# Altium project MIL_STD_1275D_PROTECTION.PrjPcb (part 3 of 4)
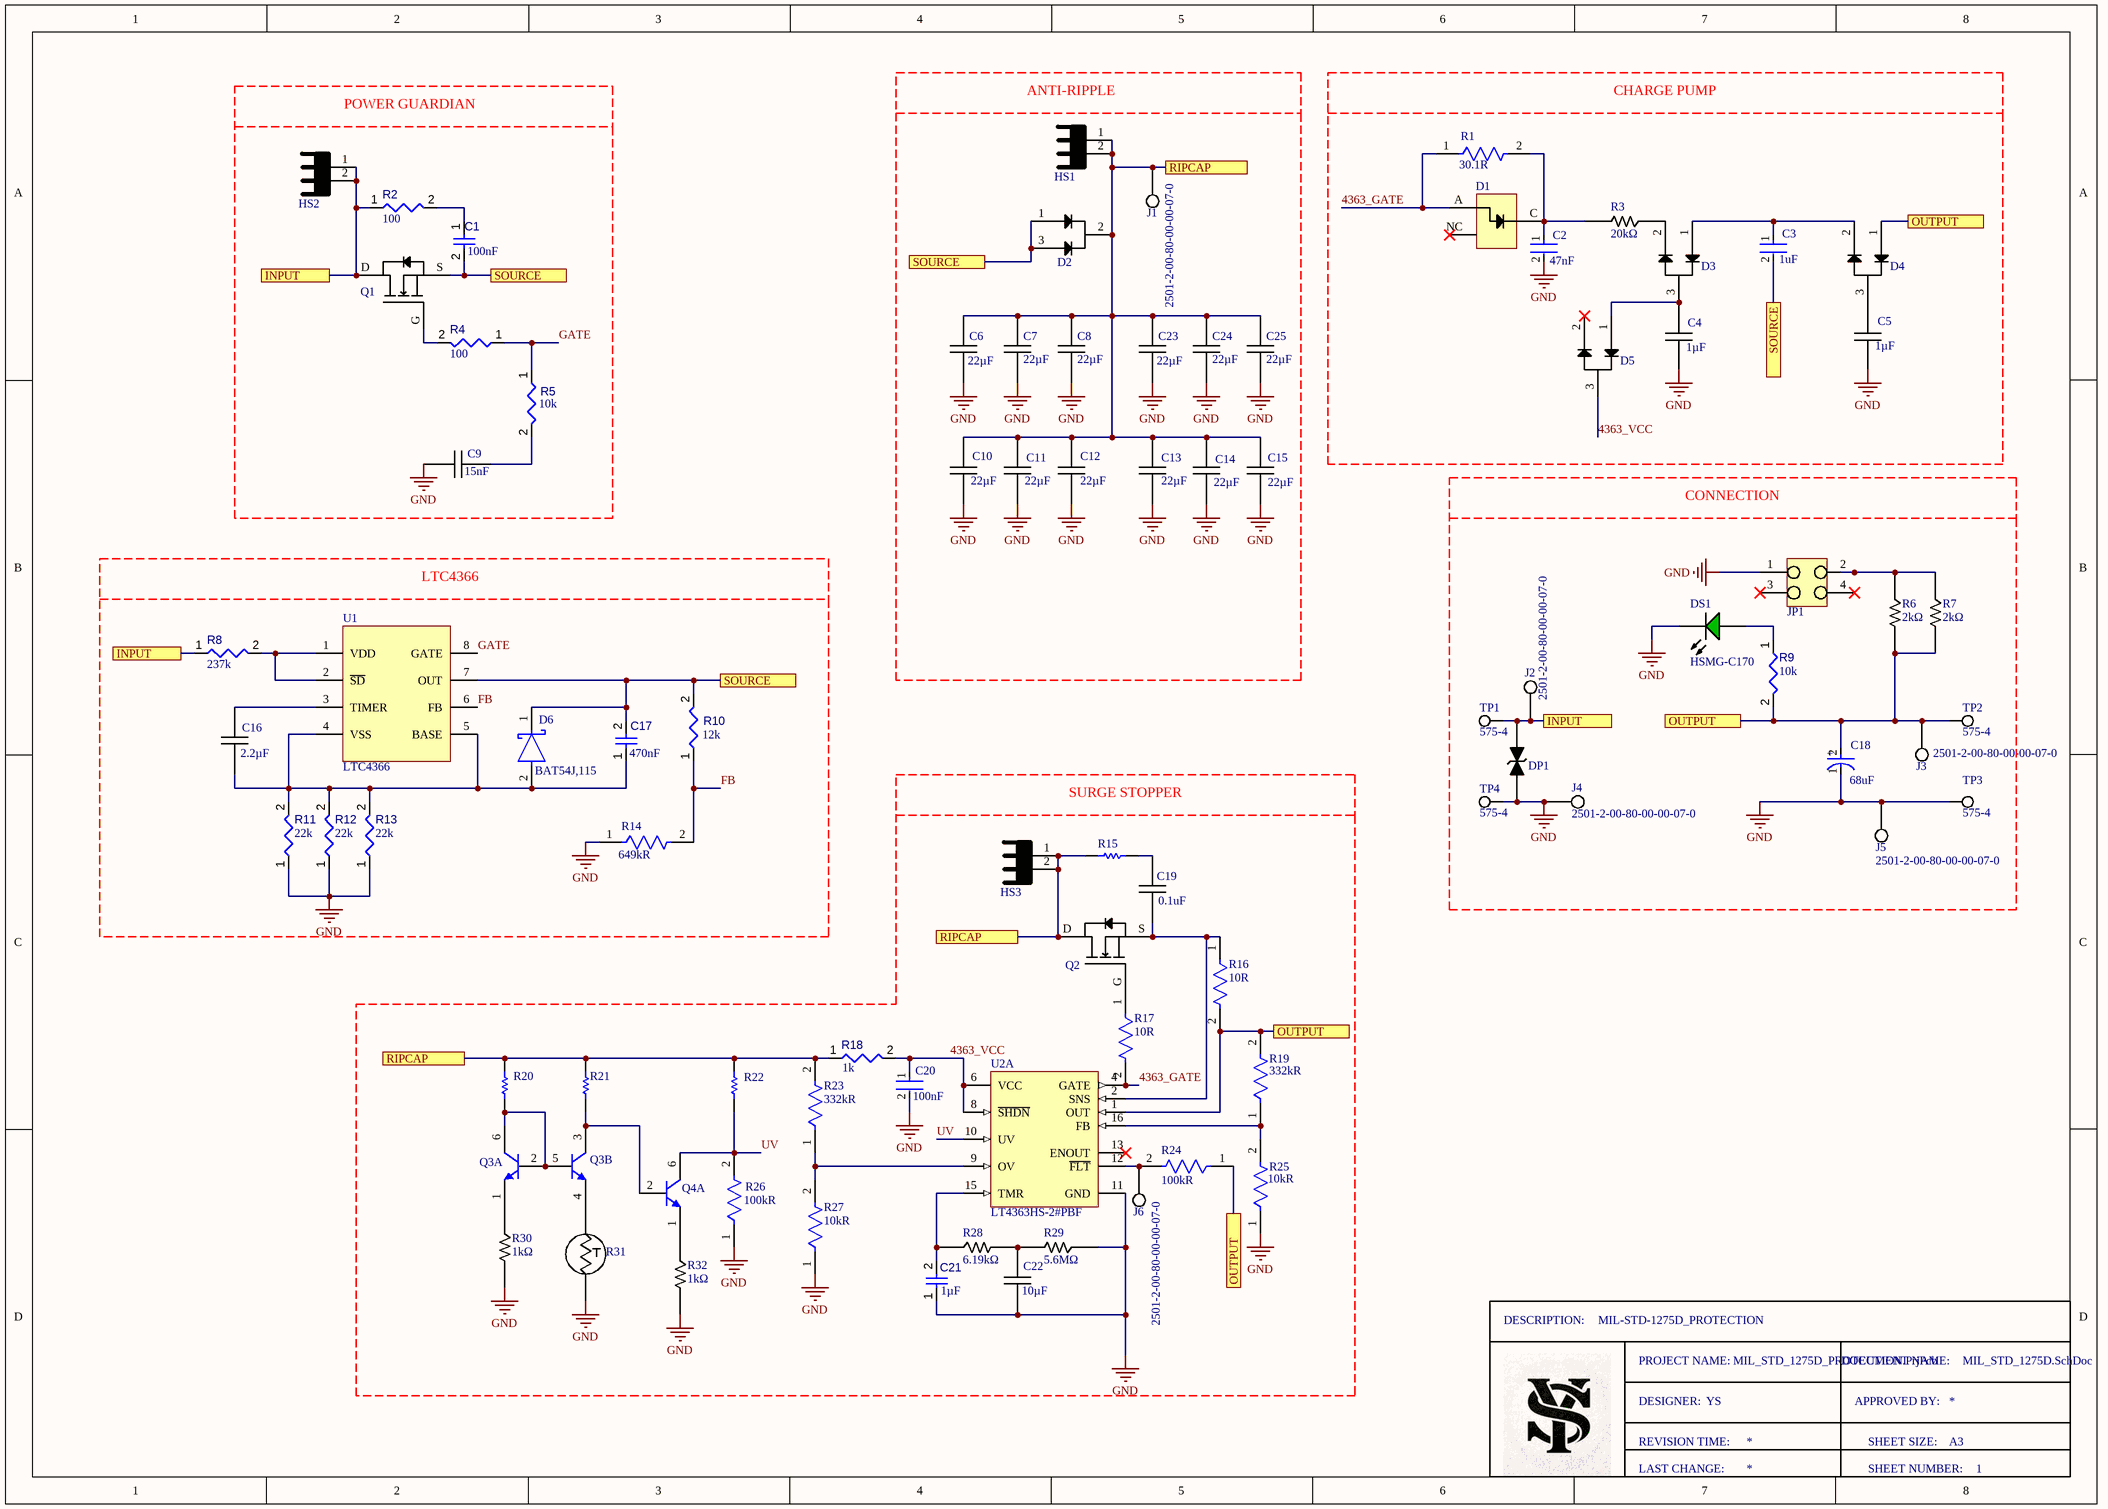
[diagram p2: MIL_STD_1275D.SchDoc]

## Sheet MIL_STD_1275D.SchDoc: MIL-STD-1275D_PROTECTION (continued)

### Library data of the parts (continued)
Q2 = IXTQ170N10P: Trans MOSFET N-CH 100V 170A 3-Pin(3+Tab) TO-3P; Manufacturer: Littelfuse; Drain to Source Resistance: 9mΩ; Element Configuration: Single; Fall Time: 33ns; Gate to Source Voltage (Vgs): 20V; Input Capacitance: 6nF; Max Power Dissipation: 715W; Number of Elements: 1; Reverse Recovery Time: 120ns; Rise Time: 50ns; Threshold Voltage: 5V; Turn-Off Delay Time: 90ns; Designed by: YS; Supplier: Farnell; Supplier Part Number: IXTQ170N10P; Manufacturer Part Number: IXTQ170N10P; RoHS: Compliant; Category: MOSFETs; Pricing: 1=5,85, 25=5,45, 100=4,45, 250=3,98, 500=3,68 (EUR); China RoHS: Compliant; Continuous Drain Current (ID): 170A; Drain to Source Breakdown Voltage: 100V; Drain to Source Voltage (Vdss): 100V; Export Control Classification Number (ECCN) Code: EAR99; Introduction Date: 2004-06-09; Lifecycle Status: Production; Max Operating Temperature: 175°C; Min Breakdown Voltage: 100V; Min Operating Temperature: -55°C; Mounting Technology: Through Hole; Pins: 3; Number of Terminals: 3; Power Dissipation: 715W; Rds On Max: 9mΩ; REACH SVHC: Yes; ComponentLink1URL: https://datasheet.octopart.com:443/IXTQ170N10P-Littelfuse-datasheet-140812726.pdf?src-supplier=IHS; ComponentLink1Description: https://datasheet.octopart.com:443/IXTQ170N10P-Littelfuse-datasheet-140812726.pdf?src-supplier=IHS; ComponentLink2URL: https://datasheet.octopart.com:443/IXTQ170N10P-Littelfuse-datasheet-180607976.pdf?src-supplier=IHS; ComponentLink2Description: https://datasheet.octopart.com:443/IXTQ170N10P-Littelfuse-datasheet-180607976.pdf?src-supplier=IHS; ComponentLink3URL: https://datasheet.octopart.com:443/IXTQ170N10P-IXYS-datasheet-11764712.pdf?src-supplier=LKR; ComponentLink3Description: https://datasheet.octopart.com:443/IXTQ170N10P-IXYS-datasheet-11764712.pdf?src-supplier=LKR; ComponentLink4URL: https://datasheet.octopart.com:443/IXTQ170N10P-IXYS-datasheet-5325121.pdf?src-supplier=element14+APAC; ComponentLink4Description: https://datasheet.octopart.com:443/IXTQ170N10P-IXYS-datasheet-5325121.pdf?src-supplier=element14+APAC; ComponentLink5URL: https://datasheet.octopart.com:443/IXTQ170N10P-IXYS-datasheet-10725190.pdf?src-supplier=iiiC; ComponentLink5Description: https://datasheet.octopart.com:443/IXTQ170N10P-IXYS-datasheet-10725190.pdf?src-supplier=iiiC
Q3 Q4 = CMP-2000-06740-1: Dual NPN Small Signal Surface Mount Transistor, 160 V, 200 mA, -55 to 150 degC, 6-Pin SOT-363, RoHS, Tape and Reel; Collector- Base Voltage VCBO: 180V; DC Collector/Base Gain hfe Min: 80; Unit Weight: 0.000212oz; Brand: DiodesIncorporated; Maximum DC Collector Current: 0.2A; Collector- Emitter Voltage VCEO Max: 160V; Gain Bandwidth Product fT: 300MHz; Pd - Power Dissipation: 0.2W; Emitter- Base Voltage VEBO: 6V; Collector-Emitter Saturation Voltage: 0.2V; DC Current Gain hFE Max: 250; Mounting Technology: SurfaceMount; Maximum Operating Temperature: +150C; Packaging: Reel; Height: 1mm; Datasheet Version: Rev. 8-2, 05/2009; Manufacturer: DiodesIncorporated; RoHS: True; Datasheet URL: http://www.diodes.com/_files/datasheets/ds30172.pdf; Product Category: BipolarTransistors-BJT; Minimum Operating Temperature: -55C; Package Reference: SOT-363-6; Configuration: Dual; Continuous Collector Current: 0.2A; Transistor Polarity: NPN; Package / Case: SOT-363; Width: 1.35mm; Package Description: 6-Pin Small Outline Transistor, Body 2 x 1.25 mm, Pitch 0.65 mm; Mounting Style: SMD/SMT; Length: 2.2mm; Manufacturer URL: http://www.diodes.com/; Series: MMDT55; Factory Pack Quantity: 3000
R1 = CMP-2001-03812-2: RES Thick Film, 30.1Ω, 1%, 0.125W, 100ppm/°C, 0805; Max Power Dissipation: 125mW; Voltage Rating: 150V; Max Operating Temperature: 155°C; Composition: Thick Film; Case Code (Imperial): 0805; Package Quantity: 10; Tolerance: 1%; Number of Terminations: 2; Packaging: Tape and Reel; Features: Automotive AEC-Q200; Width: 0.049inch; Depth: 1.25mm; Length: 2mm; Case/Package: 0805; Military Standard: Not; Height: 0.02inch; Weight: 0.000194oz; Case Code (Metric): 2012; Termination: SMD/SMT; Power Rating: 125mW; Radiation Hardening: No; Temperature Coefficient: 100ppm/°C; Number of Pins: 2; Contact Plating: Tin; Min Operating Temperature: -55°C
R2 R4 = CMP-009-00167-3: Chip Resistor, 100 Ohms, +/-1 %, 63 mW, -55 to 155 degC, 0402; Power: 63mW; Tolerance: 1%; Min Operating Temperature: -55°C; Case/Package: 0402; Pins: 2; Max Operating Temperature: 155°C
R3 = CRCW080520K0JNEA: Fixed Resistor, Metal Glaze/Thick Film, 0.125W, 20000ohm, 150V, 5% +/-Tol, Surface Mount, 0805; Manufacturer: Vishay; Manufacturer Package Identifier: CRCW0805-e3; Max Power Dissipation: 125mW; Temperature Coefficient: 200ppm/°C; Designed by: YS; Supplier: Mouser; Supplier Part Number: 71-CRCW0805J-20K-E3; Manufacturer Part Number: CRCW080520K0JNEA; RoHS: Compliant; Category: Chip SMD Resistors; Stock: 5247; Pricing: 1=0,1, 10=0,023, 50=0,023, 100=0,019, 1000=0,011, 10000=0,005 (USD); Case/Package: 0805; Case Code (Imperial): 0805; China RoHS: Non-Compliant; Composition: Thick Film; Contact Plating: Tin; Country of Origin: Israel; Depth: 1.25mm; Export Control Classification Number (ECCN) Code: EAR99; Features: Automotive AEC-Q200; Height: 450µm; Harmonized Tariff Schedule (HTS) Code: 8533.21.00.30; Introduction Date: 2005-02-16; Lead Free: Lead Free; Length: 2mm; Lifecycle Status: Production; Max Operating Temperature: 155°C; Military Standard: Not; Min Operating Temperature: -55°C; Mounting Technology: Surface Mount; Pins: 2; Number of Terminals: 2; Number of Terminations: 2; Packaging: Cut Tape; Power Rating: 125mW; Radiation Hardening: No; Ratings: AEC-Q200; REACH SVHC: Yes; Schedule B: 8533210045; Termination: Solder; Tolerance: 5%; Voltage Rating: 150V; Voltage Rating (DC): 150V; Weight: 5.499807mg; Width: 1.25mm; Working Voltage: 150V; ComponentLink1URL: https://datasheet.octopart.com:443/CRCW080520K0JNEA-Vishay-datasheet-175423584.pdf?src-supplier=IHS; ComponentLink1Description: https://datasheet.octopart.com:443/CRCW080520K0JNEA-Vishay-datasheet-175423584.pdf?src-supplier=IHS; ComponentLink2URL: https://datasheet.octopart.com:443/CRCW080520K0JNEA-Vishay-datasheet-190005712.pdf?src-supplier=TME; ComponentLink2Description: https://datasheet.octopart.com:443/CRCW080520K0JNEA-Vishay-datasheet-190005712.pdf?src-supplier=TME; ComponentLink3URL: https://datasheet.octopart.com:443/CRCW080520K0JNEA-Vishay-datasheet-68554530.pdf?src-supplier=Farnell; ComponentLink3Description: https://datasheet.octopart.com:443/CRCW080520K0JNEA-Vishay-datasheet-68554530.pdf?src-supplier=Farnell; ComponentLink4URL: https://datasheet.octopart.com:443/CRCW080520K0JNEA-Vishay-datasheet-31669108.pdf?src-supplier=Farnell; ComponentLink4Description: https://datasheet.octopart.com:443/CRCW080520K0JNEA-Vishay-datasheet-31669108.pdf?src-supplier=Farnell; ComponentLink5URL: https://datasheet.octopart.com:443/CRCW080520K0JNEA-Vishay-datasheet-33013972.pdf?src-supplier=element14+APAC; ComponentLink5Description: https://datasheet.octopart.com:443/CRCW080520K0JNEA-Vishay-datasheet-33013972.pdf?src-supplier=element14+APAC; ComponentLink6URL: https://datasheet.octopart.com:443/CRCW080520K0JNEA-Vishay-datasheet-62317937.pdf?src-supplier=Newark; ComponentLink6Description: https://datasheet.octopart.com:443/CRCW080520K0JNEA-Vishay-datasheet-62317937.pdf?src-supplier=Newark; ComponentLink7URL: https://datasheet.octopart.com:443/CRCW080520K0JNEA-Vishay-datasheet-159614168.pdf?src-supplier=Newark; ComponentLink7Description: https://datasheet.octopart.com:443/CRCW080520K0JNEA-Vishay-datasheet-159614168.pdf?src-supplier=Newark; ComponentLink8URL: https://datasheet.octopart.com:443/CRCW080520K0JNEA-Vishay-datasheet-66077789.pdf?src-supplier=Newark; ComponentLink8Description: https://datasheet.octopart.com:443/CRCW080520K0JNEA-Vishay-datasheet-66077789.pdf?src-supplier=Newark; ComponentLink9URL: https://datasheet.octopart.com:443/CRCW080520K0JNEA-Vishay-datasheet-41302739.pdf?src-supplier=Newark; ComponentLink9Description: https://datasheet.octopart.com:443/CRCW080520K0JNEA-Vishay-datasheet-41302739.pdf?src-supplier=Newark; ComponentLink10URL: https://datasheet.octopart.com:443/CRCW080520K0JNEA-Vishay-datasheet-62316122.pdf?src-supplier=Future+Electronics; ComponentLink10Description: https://datasheet.octopart.com:443/CRCW080520K0JNEA-Vishay-datasheet-62316122.pdf?src-supplier=Future+Electronics; ComponentLink11URL: https://datasheet.octopart.com:443/CRCW080520K0JNEA-Vishay-datasheet-5300368.pdf?src-supplier=Future+Electronics; ComponentLink11Description: https://datasheet.octopart.com:443/CRCW080520K0JNEA-Vishay-datasheet-5300368.pdf?src-supplier=Future+Electronics; ComponentLink12URL: https://datasheet.octopart.com:443/CRCW080520K0JNEA-Vishay-Dale-datasheet-47688880.pdf?src-supplier=RS+(Formerly+Allied+Electronics); ComponentLink12Description: https://datasheet.octopart.com:443/CRCW080520K0JNEA-Vishay-Dale-datasheet-47688880.pdf?src-supplier=RS+(Formerly+Allied+Electronics); ComponentLink13URL: https://datasheet.octopart.com:443/CRCW080520K0JNEA-Vishay-datasheet-12001583.pdf?src-supplier=RS+(Formerly+Allied+Electronics); ComponentLink13Description: https://datasheet.octopart.com:443/CRCW080520K0JNEA-Vishay-datasheet-12001583.pdf?src-supplier=RS+(Formerly+Allied+Electronics); ComponentLink14URL: https://datasheet.octopart.com:443/CRCW080520K0JNEA-Vishay-datasheet-5306405.pdf?src-supplier=RS+(Formerly+Allied+Electronics); ComponentLink14Description: https://datasheet.octopart.com:443/CRCW080520K0JNEA-Vishay-datasheet-5306405.pdf?src-supplier=RS+(Formerly+Allied+Electronics); ComponentLink15URL: https://datasheet.octopart.com:443/CRCW080520K0JNEA-Vishay-datasheet-11540273.pdf?src-supplier=Arrow+Electronics; ComponentLink15Description: https://datasheet.octopart.com:443/CRCW080520K0JNEA-Vishay-datasheet-11540273.pdf?src-supplier=Arrow+Electronics; ComponentLink16URL: https://datasheet.octopart.com:443/CRCW080520K0JNEA-Vishay-datasheet-8445837.pdf?src-supplier=element14; ComponentLink16Description: https://datasheet.octopart.com:443/CRCW080520K0JNEA-Vishay-datasheet-8445837.pdf?src-supplier=element14; ComponentLink17URL: https://datasheet.octopart.com:443/CRCW080520K0JNEA-Vishay-datasheet-5377306.pdf?src-supplier=Garrett; ComponentLink17Description: https://datasheet.octopart.com:443/CRCW080520K0JNEA-Vishay-datasheet-5377306.pdf?src-supplier=Garrett; ComponentLink18URL: https://datasheet.octopart.com:443/CRCW080520K0JNEA-Vishay-datasheet-148188.pdf?src-supplier=Garrett; ComponentLink18Description: https://datasheet.octopart.com:443/CRCW080520K0JNEA-Vishay-datasheet-148188.pdf?src-supplier=Garrett; ComponentLink19URL: https://datasheet.octopart.com:443/CRCW080520K0JNEA-Vishay-datasheet-34203.pdf?src-supplier=Garrett; ComponentLink19Description: https://datasheet.octopart.com:443/CRCW080520K0JNEA-Vishay-datasheet-34203.pdf?src-supplier=Garrett; ComponentLink20URL: http://sigma.octopart.com:80/rohs_statement/Vishay-company-15.pdf?src-supplier=Compliance+Statements; ComponentLink20Description: http://sigma.octopart.com:80/rohs_statement/Vishay-company-15.pdf?src-supplier=Compliance+Statements
R5 = CMP-009-00019-5: Chip Resistor, 10 KOhm, +/- 1%, 63 mW, -55 to 155 degC, 0402 (1005 Metric); Power: 63mW; Voltage Rating: 50V; Case/Package: 0402; Mounting Technology: SM; Pins: 2; Min Operating Temperature: -55°C; Tolerance: 1%; RoHS Compliant: True; Max Operating Temperature: 155°C
R6 R7 = CRCW20102K00FKEFHP: Res Thick Film 2010 2K Ohm 1% 1W ±100ppm/C Pad SMD T/R Automotive AEC-Q200; Manufacturer: Vishay; Temperature Coefficient: 100ppm/°C; Voltage Rating: 400V; Supplier: Farnell; Supplier Part Number: CRCW20102K00FKEFHP; Manufacturer Part Number: CRCW20102K00FKEFHP; RoHS: Compliant; Category: Chip SMD Resistors; Stock: 1815; Pricing: 10=0,289, 100=0,235, 500=0,219, 1000=0,199, 2000=0,182, 4000=0,169 (EUR); Case/Package: 2010; Case Code (Imperial): 2010; Case Code (Metric): 5025; China RoHS: Non-Compliant; Composition: Thick Film; Contact Plating: Tin; Country of Origin: Israel; Export Control Classification Number (ECCN) Code: EAR99; Features: Automotive AEC-Q200; Height: 600µm; Harmonized Tariff Schedule (HTS) Code: 8533.21.00.30; Introduction Date: 2008-07-29; Lead Free: Lead Free; Length: 5mm; Lifecycle Status: Production; Max Operating Temperature: 155°C; Max Power Dissipation: 1W; Min Operating Temperature: -55°C; Mounting Technology: Surface Mount; Number of Terminals: 2; Number of Terminations: 2; Power Rating: 1W; Radiation Hardening: No; Ratings: AEC-Q200; REACH SVHC: Yes; Schedule B: 8533210045, 8533210045|8533210045|8533210045|8533210045|8533210045; Tolerance: 1%; Voltage Rating (DC): 400V; Weight: 25.486221mg; Width: 2.5mm; Working Voltage: 400V; ComponentLink1URL: https://datasheet.octopart.com:443/CRCW20102K00FKEFHP-Vishay-datasheet-83567917.pdf?src-supplier=Upverter; ComponentLink1Description: https://datasheet.octopart.com:443/CRCW20102K00FKEFHP-Vishay-datasheet-83567917.pdf?src-supplier=Upverter; ComponentLink2URL: https://datasheet.octopart.com:443/CRCW20102K00FKEFHP-Vishay-datasheet-62316122.pdf?src-supplier=Future+Electronics; ComponentLink2Description: https://datasheet.octopart.com:443/CRCW20102K00FKEFHP-Vishay-datasheet-62316122.pdf?src-supplier=Future+Electronics; ComponentLink3URL: https://datasheet.octopart.com:443/CRCW20102K00FKEFHP-Vishay-datasheet-13148866.pdf?src-supplier=Future+Electronics; ComponentLink3Description: https://datasheet.octopart.com:443/CRCW20102K00FKEFHP-Vishay-datasheet-13148866.pdf?src-supplier=Future+Electronics; ComponentLink4URL: https://datasheet.octopart.com:443/CRCW20102K00FKEFHP-Vishay-datasheet-13131392.pdf?src-supplier=Future+Electronics; ComponentLink4Description: https://datasheet.octopart.com:443/CRCW20102K00FKEFHP-Vishay-datasheet-13131392.pdf?src-supplier=Future+Electronics; ComponentLink5URL: https://datasheet.octopart.com:443/CRCW20102K00FKEFHP-Vishay-datasheet-12593106.pdf?src-supplier=Future+Electronics; ComponentLink5Description: https://datasheet.octopart.com:443/CRCW20102K00FKEFHP-Vishay-datasheet-12593106.pdf?src-supplier=Future+Electronics; ComponentLink6URL: https://datasheet.octopart.com:443/CRCW20102K00FKEFHP-Vishay-datasheet-12544674.pdf?src-supplier=Future+Electronics; ComponentLink6Description: https://datasheet.octopart.com:443/CRCW20102K00FKEFHP-Vishay-datasheet-12544674.pdf?src-supplier=Future+Electronics; ComponentLink7URL: https://datasheet.octopart.com:443/CRCW20102K00FKEFHP-Vishay-datasheet-12531795.pdf?src-supplier=Future+Electronics; ComponentLink7Description: https://datasheet.octopart.com:443/CRCW20102K00FKEFHP-Vishay-datasheet-12531795.pdf?src-supplier=Future+Electronics; ComponentLink8URL: https://datasheet.octopart.com:443/CRCW20102K00FKEFHP-Vishay-datasheet-12518686.pdf?src-supplier=Future+Electronics; ComponentLink8Description: https://datasheet.octopart.com:443/CRCW20102K00FKEFHP-Vishay-datasheet-12518686.pdf?src-supplier=Future+Electronics; ComponentLink9URL: https://datasheet.octopart.com:443/CRCW20102K00FKEFHP-Vishay-datasheet-12509906.pdf?src-supplier=Future+Electronics; ComponentLink9Description: https://datasheet.octopart.com:443/CRCW20102K00FKEFHP-Vishay-datasheet-12509906.pdf?src-supplier=Future+Electronics; ComponentLink10URL: https://datasheet.octopart.com:443/CRCW20102K00FKEFHP-Vishay-datasheet-10669844.pdf?src-supplier=Future+Electronics; ComponentLink10Description: https://datasheet.octopart.com:443/CRCW20102K00FKEFHP-Vishay-datasheet-10669844.pdf?src-supplier=Future+Electronics; ComponentLink11URL: https://datasheet.octopart.com:443/CRCW20102K00FKEFHP-Vishay-datasheet-8703221.pdf?src-supplier=Future+Electronics; ComponentLink11Description: https://datasheet.octopart.com:443/CRCW20102K00FKEFHP-Vishay-datasheet-8703221.pdf?src-supplier=Future+Electronics; ComponentLink12URL: http://sigma.octopart.com:80/rohs_statement/Vishay-company-15.pdf?src-supplier=Compliance+Statements; ComponentLink12Description: http://sigma.octopart.com:80/rohs_statement/Vishay-company-15.pdf?src-supplier=Compliance+Statements
R8 = CMP-009-00150-3: Chip Resistor, 237 kOhms, +/-1 %, 63 mW, -55 to 155 degC, 0402; Power: 63mW; Tolerance: 1%; Min Operating Temperature: -55°C; Max Operating Temperature: 155°C; Pins: 2; Case/Package: 0402
R9 = CMP-009-00016-5: Chip Resistor, 10 KOhm, +/- 1%, 0.25 W, -55 to 155 degC, 1206 (3216 Metric); Power: 250mW; Voltage Rating: 200V; Pins: 2; Max Operating Temperature: 155°C; Tolerance: 1%; RoHS Compliant: True; Case/Package: 1206; Min Operating Temperature: -55°C; Mounting Technology: SM
R10 = CMP-009-00071-2: 12K 0.063W 1% 0402 (1005 Metric)  SMD; Power: 63mW; Tolerance: 1%; Case/Package: 0402; Mounting Technology: SMT; Pins: 2
R11-R13 = CMP-009-00081-2: 22K 0.063W 1% 0402 (1005 Metric)  SMD; Power: 63mW; Tolerance: 1%; Pins: 2; Mounting Technology: SMT; Case/Package: 0402
R14 = CMP-2003-02329-2: RES Thick Film, 649kΩ, 1%, 0.25W, 100ppm/°C, 1206; Voltage Rating (DC): 200V; Max Power Dissipation: 250mW; Height: 0.024inch; Min Operating Temperature: -55°C; Military Standard: Not; Lead Free: Lead Free; Composition: Thick Film; Case Code (Imperial): 1206; Tolerance: 1%; Case/Package: 1206; Features: Automotive AEC-Q200; Package Quantity: 10; Contact Plating: Tin; Weight: 0.000353oz; Termination: SMD/SMT; Radiation Hardening: No; Case Code (Metric): 3216; Max Operating Temperature: 155°C; Temperature Coefficient: 100ppm/°C; Power Rating: 250mW; Depth: 1.6mm; Packaging: Tape and Reel; Length: 3.2mm; Voltage Rating: 200V; Number of Pins: 2; Width: 0.063inch; Number of Terminations: 2
R15 = CMP-2005-00215-1: Manufacturer: Vishay Dale; Part Number: CRCW1210100RJNEAHP
R16 R17 = CMP-2001-04916-2: RES Thick Film, 10Ω, 5%, 0.125W, 200ppm/°C, 0805; Max Power Dissipation: 125mW; Voltage Rating: 150V; Depth: 1.25mm; Weight: 0.000194oz; Length: 2mm; Features: Automotive AEC-Q200; Package Quantity: 1; Width: 1.25mm; Radiation Hardening: No; Case Code (Metric): 2012; Min Operating Temperature: -55°C; Max Operating Temperature: 155°C; Tolerance: 5%; Packaging: Tape and Reel; Termination: SMD/SMT; Number of Pins: 2; Number of Terminations: 2; Voltage Rating (DC): 150V; Temperature Coefficient: 200ppm/°C; Power Rating: 125mW; Case Code (Imperial): 0805; Lead Free: Lead Free; Composition: Thick Film; Height: 0.02inch; Military Standard: Not; Contact Plating: Tin; Case/Package: 0805; Mount: Surface Mount
R18 = CMP-009-00075-2: 1K 0.063W 5% 0402 (1005 Metric)  SMD; Power: 63mW; Pins: 2; Mounting Technology: SMT; Case/Package: 0402; Tolerance: 5%
R19 R23 = CMP-2001-03825-2: RES Thick Film, 332kΩ, 1%, 0.125W, 100ppm/°C, 0805; Voltage Rating: 150V; Power Rating: 125mW; Min Operating Temperature: -55°C; Max Operating Temperature: 155°C; Temperature Coefficient: 100ppm/°C; Height: 0.45mm; Number of Pins: 2; Composition: Thick Film; Weight: 0.000194oz; Features: Automotive AEC-Q200; Termination: SMD/SMT; Tolerance: 1%; Contact Plating: Tin; Case/Package: 0805; Number of Terminations: 2; Package Quantity: 10; Case Code (Metric): 2012; Packaging: Tape and Reel; Case Code (Imperial): 0805; Width: 0.049inch; Max Power Dissipation: 125mW; Radiation Hardening: No; Lead Free: Lead Free; Military Standard: Not; Voltage Rating (DC): 150V; Depth: 1.25mm; Length: 2mm
R20-R22 = CMP-2001-03800-1: Manufacturer: Vishay Dale; Part Number: CRCW0805301KFKEA
R24 R26 = CMP-2001-04899-2: RES Thick Film, 100kΩ, 1%, 0.125W, 100ppm/°C, 0805; Power Rating: 125mW; Voltage Rating: 150V; Case/Package: 0805; Max Operating Temperature: 155°C; Case Code (Imperial): 0805; Lead Free: Lead Free; Weight: 0.000194oz; Number of Pins: 2; Package Quantity: 5000; Height: 0.45mm; Composition: Thick Film; Military Standard: Not; Tolerance: 1%; Case Code (Metric): 2012; Termination: SMD/SMT; Mount: Surface Mount; Radiation Hardening: No; Width: 1.25mm; Length: 2mm; Depth: 1.25mm; Packaging: Tape and Reel; Min Operating Temperature: -55°C; Contact Plating: Tin; Temperature Coefficient: 100ppm/°C; Voltage Rating (DC): 150V
R25 R27 = CMP-2001-04908-2: RES Thick Film, 10kΩ, 1%, 0.125W, 100ppm/°C, 0805; Voltage Rating (DC): 150V; Power Rating: 125mW; Weight: 0.000194oz; Package Quantity: 5000; Military Standard: Not; Max Operating Temperature: 155°C; Temperature Coefficient: 100ppm/°C; Contact Plating: Tin; Width: 1.25mm; Height: 0.45mm; Radiation Hardening: No; Tolerance: 1%; Min Operating Temperature: -55°C; Voltage Rating: 150V; Length: 2mm; Depth: 1.25mm; Termination: SMD/SMT; Packaging: Tape and Reel; Case/Package: 0805; Case Code (Metric): 2012; Lead Free: Lead Free; Case Code (Imperial): 0805; Composition: Thick Film
R28 = CRCW08056K19FKEA: Fixed Resistor, Metal Glaze/Thick Film, 0.125W, 6190ohm, 150V, 1% +/-Tol, Surface Mount, 0805; Manufacturer: Vishay; Manufacturer Package Identifier: CRCW0805-e3; Power Rating: 125mW; Temperature Coefficient: 100ppm/°C; Designed by: YS; Supplier: Mouser; Supplier Part Number: 71-CRCW0805-6.19K-E3; Manufacturer Part Number: CRCW08056K19FKEA; RoHS: Compliant; Category: Chip SMD Resistors; Stock: 16143; Pricing: 1=0,1, 10=0,028, 50=0,028, 100=0,023, 1000=0,014, 10000=0,007 (USD); Case/Package: 0805; Case Code (Imperial): 0805; China RoHS: Non-Compliant; Composition: Thick Film; Contact Plating: Tin; Depth: 1.25mm; Height: 450µm; Lead Free: Lead Free; Length: 2mm; Lifecycle Status: Production; Max Operating Temperature: 155°C; Military Standard: Not; Min Operating Temperature: -55°C; Mounting Technology: Surface Mount; Pins: 2; Number of Terminals: 2; Packaging: Cut Tape; Ratings: AEC-Q200; REACH SVHC: Yes; Schedule B: 8533210045, 8533210045|8533210045|8533210045|8533210045|8533210045|8533210045|8533210045|8533210045|8533210045|8533210045|8533210045|8533210045|8533210045|8533210045|8533210045|8533210045|8533210045|8533210045|8533210045|8533210045|8533210045|8533210045|8533210045|85; Termination: SMD/SMT; Tolerance: 1%; Voltage Rating: 150V; Voltage Rating (DC): 150V; Weight: 5.499807mg; Width: 1.25mm; Working Voltage: 150V; ComponentLink1URL: https://datasheet.octopart.com:443/CRCW08056K19FKEA-Vishay-datasheet-175423584.pdf?src-supplier=IHS; ComponentLink1Description: https://datasheet.octopart.com:443/CRCW08056K19FKEA-Vishay-datasheet-175423584.pdf?src-supplier=IHS; ComponentLink2URL: https://datasheet.octopart.com:443/CRCW08056K19FKEA-Vishay-datasheet-190005712.pdf?src-supplier=TME; ComponentLink2Description: https://datasheet.octopart.com:443/CRCW08056K19FKEA-Vishay-datasheet-190005712.pdf?src-supplier=TME; ComponentLink3URL: https://datasheet.octopart.com:443/CRCW08056K19FKEA-Vishay-datasheet-83961561.pdf?src-supplier=Farnell; ComponentLink3Description: https://datasheet.octopart.com:443/CRCW08056K19FKEA-Vishay-datasheet-83961561.pdf?src-supplier=Farnell; ComponentLink4URL: https://datasheet.octopart.com:443/CRCW08056K19FKEA-Vishay-datasheet-62317937.pdf?src-supplier=Farnell; ComponentLink4Description: https://datasheet.octopart.com:443/CRCW08056K19FKEA-Vishay-datasheet-62317937.pdf?src-supplier=Farnell; ComponentLink5URL: https://datasheet.octopart.com:443/CRCW08056K19FKEA-Vishay-datasheet-14722531.pdf?src-supplier=Farnell; ComponentLink5Description: https://datasheet.octopart.com:443/CRCW08056K19FKEA-Vishay-datasheet-14722531.pdf?src-supplier=Farnell; ComponentLink6URL: https://datasheet.octopart.com:443/CRCW08056K19FKEA-Vishay-datasheet-5299586.pdf?src-supplier=Farnell; ComponentLink6Description: https://datasheet.octopart.com:443/CRCW08056K19FKEA-Vishay-datasheet-5299586.pdf?src-supplier=Farnell; ComponentLink7URL: https://datasheet.octopart.com:443/CRCW08056K19FKEA-Vishay-datasheet-10380026.pdf?src-supplier=Farnell; ComponentLink7Description: https://datasheet.octopart.com:443/CRCW08056K19FKEA-Vishay-datasheet-10380026.pdf?src-supplier=Farnell; ComponentLink8URL: https://datasheet.octopart.com:443/CRCW08056K19FKEA-Vishay-datasheet-11516975.pdf?src-supplier=Farnell; ComponentLink8Description: https://datasheet.octopart.com:443/CRCW08056K19FKEA-Vishay-datasheet-11516975.pdf?src-supplier=Farnell; ComponentLink9URL: https://datasheet.octopart.com:443/CRCW08056K19FKEA-Vishay-datasheet-5300368.pdf?src-supplier=Farnell; ComponentLink9Description: https://datasheet.octopart.com:443/CRCW08056K19FKEA-Vishay-datasheet-5300368.pdf?src-supplier=Farnell; ComponentLink10URL: https://datasheet.octopart.com:443/CRCW08056K19FKEA-Vishay-datasheet-66077789.pdf?src-supplier=Newark; ComponentLink10Description: https://datasheet.octopart.com:443/CRCW08056K19FKEA-Vishay-datasheet-66077789.pdf?src-supplier=Newark; ComponentLink11URL: https://datasheet.octopart.com:443/CRCW08056K19FKEA-Vishay-datasheet-41302739.pdf?src-supplier=Newark; ComponentLink11Description: https://datasheet.octopart.com:443/CRCW08056K19FKEA-Vishay-datasheet-41302739.pdf?src-supplier=Newark; ComponentLink12URL: https://datasheet.octopart.com:443/CRCW08056K19FKEA-Vishay-datasheet-33013972.pdf?src-supplier=Newark; ComponentLink12Description: https://datasheet.octopart.com:443/CRCW08056K19FKEA-Vishay-datasheet-33013972.pdf?src-supplier=Newark; ComponentLink13URL: https://datasheet.octopart.com:443/CRCW08056K19FKEA-Vishay-datasheet-10882403.pdf?src-supplier=element14+APAC; ComponentLink13Description: https://datasheet.octopart.com:443/CRCW08056K19FKEA-Vishay-datasheet-10882403.pdf?src-supplier=element14+APAC; ComponentLink14URL: https://datasheet.octopart.com:443/CRCW08056K19FKEA-Vishay-datasheet-62316122.pdf?src-supplier=Future+Electronics; ComponentLink14Description: https://datasheet.octopart.com:443/CRCW08056K19FKEA-Vishay-datasheet-62316122.pdf?src-supplier=Future+Electronics; ComponentLink15URL: https://datasheet.octopart.com:443/CRCW08056K19FKEA-Vishay-datasheet-12519820.pdf?src-supplier=Future+Electronics; ComponentLink15Description: https://datasheet.octopart.com:443/CRCW08056K19FKEA-Vishay-datasheet-12519820.pdf?src-supplier=Future+Electronics; ComponentLink16URL: https://datasheet.octopart.com:443/CRCW08056K19FKEA-Vishay-Dale-datasheet-47688880.pdf?src-supplier=RS+(Formerly+Allied+Electronics); ComponentLink16Description: https://datasheet.octopart.com:443/CRCW08056K19FKEA-Vishay-Dale-datasheet-47688880.pdf?src-supplier=RS+(Formerly+Allied+Electronics); ComponentLink17URL: https://datasheet.octopart.com:443/CRCW08056K19FKEA-Vishay-datasheet-12001583.pdf?src-supplier=RS+(Formerly+Allied+Electronics); ComponentLink17Description: https://datasheet.octopart.com:443/CRCW08056K19FKEA-Vishay-datasheet-12001583.pdf?src-supplier=RS+(Formerly+Allied+Electronics); ComponentLink18URL: https://datasheet.octopart.com:443/CRCW08056K19FKEA-Vishay-datasheet-5306405.pdf?src-supplier=RS+(Formerly+Allied+Electronics); ComponentLink18Description: https://datasheet.octopart.com:443/CRCW08056K19FKEA-Vishay-datasheet-5306405.pdf?src-supplier=RS+(Formerly+Allied+Electronics); ComponentLink19URL: https://datasheet.octopart.com:443/CRCW08056K19FKEA-Vishay-datasheet-8725101.pdf?src-supplier=element14; ComponentLink19Description: https://datasheet.octopart.com:443/CRCW08056K19FKEA-Vishay-datasheet-8725101.pdf?src-supplier=element14; ComponentLink20URL: https://datasheet.octopart.com:443/CRCW08056K19FKEA-Vishay-datasheet-5377306.pdf?src-supplier=Garrett; ComponentLink20Description: https://datasheet.octopart.com:443/CRCW08056K19FKEA-Vishay-datasheet-5377306.pdf?src-supplier=Garrett; ComponentLink21URL: https://datasheet.octopart.com:443/CRCW08056K19FKEA-Vishay-datasheet-148188.pdf?src-supplier=Garrett; ComponentLink21Description: https://datasheet.octopart.com:443/CRCW08056K19FKEA-Vishay-datasheet-148188.pdf?src-supplier=Garrett; ComponentLink22URL: https://datasheet.octopart.com:443/CRCW08056K19FKEA-Vishay-datasheet-34203.pdf?src-supplier=Garrett; ComponentLink22Description: https://datasheet.octopart.com:443/CRCW08056K19FKEA-Vishay-datasheet-34203.pdf?src-supplier=Garrett; ComponentLink23URL: http://sigma.octopart.com:80/rohs_statement/Vishay-company-15.pdf?src-supplier=Compliance+Statements; ComponentLink23Description: http://sigma.octopart.com:80/rohs_statement/Vishay-company-15.pdf?src-supplier=Compliance+Statements
R29 = ERJ-6GEYJ565V: Res Thick Film 0805 5.6M Ohm 5% 0.125W(1/8W) -400ppm/C to 150ppm/C Molded SMD Punched T/R; Manufacturer: Panasonic; Manufacturer Lifecycle Status: ACTIVE; Part Series: Thick Film Chip Resistors; Max Power Dissipation: 125mW; Temperature Coefficient: 150ppm/°C; Voltage Rating: 150V; Designed by: YS; Supplier: Mouser; Supplier Part Number: 667-ERJ-6GEYJ565V; Manufacturer Part Number: ERJ-6GEYJ565V; RoHS: Compliant; Category: Chip SMD Resistors; Stock: 45373; Pricing: 1=0,1, 10=0,026, 50=0,026, 100=0,022, 1000=0,013, 10000=0,009 (USD); Case/Package: 0805; Case Code (Imperial): 0805; Composition: Thick Film; Contact Plating: Tin; Features: Automotive AEC-Q200; Height: 600µm; Length: 2mm; Lifecycle Status: Production; Max Operating Temperature: 155°C; Min Operating Temperature: -55°C; Mounting Technology: Surface Mount; Number of Terminals: 2; Number of Terminations: 2; Power Rating: 125mW; Radiation Hardening: No; Ratings: AEC-Q200; REACH SVHC: Yes; Schedule B: 8533210045; Tolerance: 5%; Voltage Rating (DC): 150V; Width: 1.25mm; Working Voltage: 150V; ComponentLink1URL: https://datasheet.octopart.com:443/ERJ6GEYJ565V-Panasonic-datasheet-170320360.pdf?src-supplier=IHS; ComponentLink1Description: https://datasheet.octopart.com:443/ERJ6GEYJ565V-Panasonic-datasheet-170320360.pdf?src-supplier=IHS; ComponentLink2URL: https://datasheet.octopart.com:443/ERJ6GEYJ565V-Panasonic-datasheet-61114972.pdf?src-supplier=Panasonic; ComponentLink2Description: https://datasheet.octopart.com:443/ERJ6GEYJ565V-Panasonic-datasheet-61114972.pdf?src-supplier=Panasonic; ComponentLink3URL: https://datasheet.octopart.com:443/ERJ-6GEYJ565V-Panasonic-datasheet-154766171.pdf?src-supplier=Master+Electronics; ComponentLink3Description: https://datasheet.octopart.com:443/ERJ-6GEYJ565V-Panasonic-datasheet-154766171.pdf?src-supplier=Master+Electronics; ComponentLink4URL: https://datasheet.octopart.com:443/ERJ6GEYJ565V-Panasonic-datasheet-165581512.pdf?src-supplier=TME; ComponentLink4Description: https://datasheet.octopart.com:443/ERJ6GEYJ565V-Panasonic-datasheet-165581512.pdf?src-supplier=TME; ComponentLink5URL: https://datasheet.octopart.com:443/ERJ6GEYJ565V-Panasonic-datasheet-138819430.pdf?src-supplier=Burklin+Elektronik; ComponentLink5Description: https://datasheet.octopart.com:443/ERJ6GEYJ565V-Panasonic-datasheet-138819430.pdf?src-supplier=Burklin+Elektronik; ComponentLink6URL: https://datasheet.octopart.com/ERJ-6GEYJ565V-Panasonic-datasheet-78375410.pdf; ComponentLink6Description: https://datasheet.octopart.com/ERJ-6GEYJ565V-Panasonic-datasheet-78375410.pdf; ComponentLink7URL: https://datasheet.octopart.com:443/ERJ-6GEYJ565V-Panasonic-datasheet-11480398.pdf?src-supplier=Arrow+Electronics; ComponentLink7Description: https://datasheet.octopart.com:443/ERJ-6GEYJ565V-Panasonic-datasheet-11480398.pdf?src-supplier=Arrow+Electronics; ComponentLink8URL: https://datasheet.octopart.com:443/ERJ-6GEYJ565V-Panasonic-datasheet-118655.pdf?src-supplier=DigiKey; ComponentLink8Description: https://datasheet.octopart.com:443/ERJ-6GEYJ565V-Panasonic-datasheet-118655.pdf?src-supplier=DigiKey; ComponentLink9URL: https://datasheet.octopart.com:443/ERJ6GEYJ565V-Panasonic-datasheet-27908757.pdf?src-supplier=Electro+Sonic; ComponentLink9Description: https://datasheet.octopart.com:443/ERJ6GEYJ565V-Panasonic-datasheet-27908757.pdf?src-supplier=Electro+Sonic; ComponentLink10URL: https://datasheet.octopart.com:443/ERJ-6GEYJ565V-Panasonic-datasheet-37173568.pdf?src-supplier=Electro+Sonic; ComponentLink10Description: https://datasheet.octopart.com:443/ERJ-6GEYJ565V-Panasonic-datasheet-37173568.pdf?src-supplier=Electro+Sonic
R30 = CRCW08051K00FKEA: 125mW Thick Film Resistors 150V ±1% ±100ppm/℃ 1kΩ 0805 Chip Resistor - Surface Mount ROHS; Manufacturer: Vishay; Manufacturer Package Identifier: CRCW0805-e3; Temperature Coefficient: 100ppm/°C; Designed by: YS; Supplier: Mouser; Supplier Part Number: 71-CRCW0805-1.0K-E3; Manufacturer Part Number: CRCW08051K00FKEA; RoHS: Compliant; Category: Chip SMD Resistors; Stock: 449461; Pricing: 1=0,1, 10=0,024, 50=0,024, 100=0,021, 1000=0,013, 10000=0,009 (USD); Case/Package: 0805; Case Code (Imperial): 0805; China RoHS: Non-Compliant; Composition: Thick Film; Contact Plating: Tin; Country of Origin: Israel; Depth: 1.25mm; Export Control Classification Number (ECCN) Code: EAR99; Height: 450µm; Harmonized Tariff Schedule (HTS) Code: 8533.21.00.30; Introduction Date: 2005-02-16; Lead Free: Lead Free; Length: 2mm; Lifecycle Status: Production; Max Operating Temperature: 155°C; Military Standard: Not; Min Operating Temperature: -55°C; Mounting Technology: Surface Mount; Pins: 2; Number of Terminals: 2; Packaging: Cut Tape; Power Rating: 125mW; Radiation Hardening: No; Ratings: AEC-Q200; REACH SVHC: Yes; Schedule B: 8533210045, 8533210045|8533210045, 8533210045|8533210045|8533210045, 8533210045|8533210045|8533210045|8533210045; Termination: SMD/SMT; Tolerance: 1%; Voltage Rating: 150V; Voltage Rating (DC): 150V; Weight: 5.499807mg; Width: 1.25mm; Working Voltage: 150V; ComponentLink1URL: https://datasheet.octopart.com:443/CRCW08051K00FKEA-Vishay-datasheet-175423584.pdf?src-supplier=IHS; ComponentLink1Description: https://datasheet.octopart.com:443/CRCW08051K00FKEA-Vishay-datasheet-175423584.pdf?src-supplier=IHS; ComponentLink2URL: https://datasheet.octopart.com/CRCW08051K00FKEA-Vishay-datasheet-14774665.pdf; ComponentLink2Description: https://datasheet.octopart.com/CRCW08051K00FKEA-Vishay-datasheet-14774665.pdf; ComponentLink3URL: https://datasheet.octopart.com:443/CRCW08051K00FKEA-Vishay-datasheet-83961561.pdf?src-supplier=Newark; ComponentLink3Description: https://datasheet.octopart.com:443/CRCW08051K00FKEA-Vishay-datasheet-83961561.pdf?src-supplier=Newark; ComponentLink4URL: https://datasheet.octopart.com:443/CRCW08051K00FKEA-Vishay-datasheet-14722531.pdf?src-supplier=Newark; ComponentLink4Description: https://datasheet.octopart.com:443/CRCW08051K00FKEA-Vishay-datasheet-14722531.pdf?src-supplier=Newark; ComponentLink5URL: https://datasheet.octopart.com:443/CRCW08051K00FKEA-Vishay-datasheet-62317937.pdf?src-supplier=Newark; ComponentLink5Description: https://datasheet.octopart.com:443/CRCW08051K00FKEA-Vishay-datasheet-62317937.pdf?src-supplier=Newark; ComponentLink6URL: https://datasheet.octopart.com:443/CRCW08051K00FKEA-Vishay-datasheet-11516975.pdf?src-supplier=Newark; ComponentLink6Description: https://datasheet.octopart.com:443/CRCW08051K00FKEA-Vishay-datasheet-11516975.pdf?src-supplier=Newark; ComponentLink7URL: https://datasheet.octopart.com:443/CRCW08051K00FKEA-Vishay-datasheet-41302739.pdf?src-supplier=Newark; ComponentLink7Description: https://datasheet.octopart.com:443/CRCW08051K00FKEA-Vishay-datasheet-41302739.pdf?src-supplier=Newark; ComponentLink8URL: https://datasheet.octopart.com:443/CRCW08051K00FKEA-Vishay-datasheet-33013972.pdf?src-supplier=Newark; ComponentLink8Description: https://datasheet.octopart.com:443/CRCW08051K00FKEA-Vishay-datasheet-33013972.pdf?src-supplier=Newark; ComponentLink9URL: https://datasheet.octopart.com:443/CRCW08051K00FKEA-Vishay-datasheet-16179825.pdf?src-supplier=element14+APAC; ComponentLink9Description: https://datasheet.octopart.com:443/CRCW08051K00FKEA-Vishay-datasheet-16179825.pdf?src-supplier=element14+APAC; ComponentLink10URL: https://datasheet.octopart.com:443/CRCW08051K00FKEA-Vishay-datasheet-66077789.pdf?src-supplier=element14+APAC; ComponentLink10Description: https://datasheet.octopart.com:443/CRCW08051K00FKEA-Vishay-datasheet-66077789.pdf?src-supplier=element14+APAC; ComponentLink11URL: https://datasheet.octopart.com:443/CRCW08051K00FKEA-Vishay-datasheet-5300368.pdf?src-supplier=Future+Electronics; ComponentLink11Description: https://datasheet.octopart.com:443/CRCW08051K00FKEA-Vishay-datasheet-5300368.pdf?src-supplier=Future+Electronics; ComponentLink12URL: https://datasheet.octopart.com:443/CRCW08051K00FKEA-Vishay-datasheet-62316122.pdf?src-supplier=Future+Electronics; ComponentLink12Description: https://datasheet.octopart.com:443/CRCW08051K00FKEA-Vishay-datasheet-62316122.pdf?src-supplier=Future+Electronics; ComponentLink13URL: https://datasheet.octopart.com:443/CRCW08051K00FKEA-Vishay-datasheet-5306405.pdf?src-supplier=RS+(Formerly+Allied+Electronics); ComponentLink13Description: https://datasheet.octopart.com:443/CRCW08051K00FKEA-Vishay-datasheet-5306405.pdf?src-supplier=RS+(Formerly+Allied+Electronics); ComponentLink14URL: https://datasheet.octopart.com:443/CRCW08051K00FKEA-Vishay-Dale-datasheet-47688880.pdf?src-supplier=RS+(Formerly+Allied+Electronics); ComponentLink14Description: https://datasheet.octopart.com:443/CRCW08051K00FKEA-Vishay-Dale-datasheet-47688880.pdf?src-supplier=RS+(Formerly+Allied+Electronics); ComponentLink15URL: https://datasheet.octopart.com:443/CRCW08051K00FKEA-Vishay-datasheet-12001583.pdf?src-supplier=RS+(Formerly+Allied+Electronics); ComponentLink15Description: https://datasheet.octopart.com:443/CRCW08051K00FKEA-Vishay-datasheet-12001583.pdf?src-supplier=RS+(Formerly+Allied+Electronics); ComponentLink16URL: https://datasheet.octopart.com:443/CRCW08051K00FKEA-Vishay-datasheet-17834126.pdf?src-supplier=TME; ComponentLink16Description: https://datasheet.octopart.com:443/CRCW08051K00FKEA-Vishay-datasheet-17834126.pdf?src-supplier=TME; ComponentLink17URL: https://datasheet.octopart.com:443/CRCW08051K00FKEA-Vishay-datasheet-13242068.pdf?src-supplier=Farnell; ComponentLink17Description: https://datasheet.octopart.com:443/CRCW08051K00FKEA-Vishay-datasheet-13242068.pdf?src-supplier=Farnell; ComponentLink18URL: https://datasheet.octopart.com:443/CRCW08051K00FKEA-Vishay-datasheet-13195083.pdf?src-supplier=Farnell; ComponentLink18Description: https://datasheet.octopart.com:443/CRCW08051K00FKEA-Vishay-datasheet-13195083.pdf?src-supplier=Farnell; ComponentLink19URL: https://datasheet.octopart.com:443/CRCW08051K00FKEA-Vishay-datasheet-13034211.pdf?src-supplier=Farnell; ComponentLink19Description: https://datasheet.octopart.com:443/CRCW08051K00FKEA-Vishay-datasheet-13034211.pdf?src-supplier=Farnell; ComponentLink20URL: https://datasheet.octopart.com:443/CRCW08051K00FKEA-Vishay-datasheet-12600034.pdf?src-supplier=Farnell; ComponentLink20Description: https://datasheet.octopart.com:443/CRCW08051K00FKEA-Vishay-datasheet-12600034.pdf?src-supplier=Farnell; ComponentLink21URL: https://datasheet.octopart.com:443/CRCW08051K00FKEA-Vishay-datasheet-12532161.pdf?src-supplier=Farnell; ComponentLink21Description: https://datasheet.octopart.com:443/CRCW08051K00FKEA-Vishay-datasheet-12532161.pdf?src-supplier=Farnell; ComponentLink22URL: https://datasheet.octopart.com:443/CRCW08051K00FKEA-Vishay-datasheet-12517896.pdf?src-supplier=Farnell; ComponentLink22Description: https://datasheet.octopart.com:443/CRCW08051K00FKEA-Vishay-datasheet-12517896.pdf?src-supplier=Farnell; ComponentLink23URL: https://datasheet.octopart.com:443/CRCW08051K00FKEA-Vishay-datasheet-12509762.pdf?src-supplier=Farnell; ComponentLink23Description: https://datasheet.octopart.com:443/CRCW08051K00FKEA-Vishay-datasheet-12509762.pdf?src-supplier=Farnell; ComponentLink24URL: https://datasheet.octopart.com:443/CRCW08051K00FKEA-Vishay-datasheet-10322335.pdf?src-supplier=Farnell; ComponentLink24Description: https://datasheet.octopart.com:443/CRCW08051K00FKEA-Vishay-datasheet-10322335.pdf?src-supplier=Farnell; ComponentLink25URL: https://datasheet.octopart.com:443/CRCW08051K00FKEA-Vishay-datasheet-8788789.pdf?src-supplier=Farnell; ComponentLink25Description: https://datasheet.octopart.com:443/CRCW08051K00FKEA-Vishay-datasheet-8788789.pdf?src-supplier=Farnell; ComponentLink26URL: https://datasheet.octopart.com:443/CRCW08051K00FKEA-Vishay-datasheet-8361388.pdf?src-supplier=Farnell; ComponentLink26Description: https://datasheet.octopart.com:443/CRCW08051K00FKEA-Vishay-datasheet-8361388.pdf?src-supplier=Farnell; ComponentLink27URL: https://datasheet.octopart.com:443/CRCW08051K00FKEA-Vishay-datasheet-546287.pdf?src-supplier=Farnell; ComponentLink27Description: https://datasheet.octopart.com:443/CRCW08051K00FKEA-Vishay-datasheet-546287.pdf?src-supplier=Farnell; ComponentLink28URL: https://datasheet.octopart.com:443/CRCW08051K00FKEA-Vishay-datasheet-11540273.pdf?src-supplier=Arrow+Electronics; ComponentLink28Description: https://datasheet.octopart.com:443/CRCW08051K00FKEA-Vishay-datasheet-11540273.pdf?src-supplier=Arrow+Electronics; ComponentLink29URL: https://datasheet.octopart.com:443/CRCW08051K00FKEA-Vishay-datasheet-8445837.pdf?src-supplier=element14; ComponentLink29Description: https://datasheet.octopart.com:443/CRCW08051K00FKEA-Vishay-datasheet-8445837.pdf?src-supplier=element14; ComponentLink30URL: https://datasheet.octopart.com:443/CRCW08051K00FKEA-Vishay-datasheet-5377306.pdf?src-supplier=Garrett; ComponentLink30Description: https://datasheet.octopart.com:443/CRCW08051K00FKEA-Vishay-datasheet-5377306.pdf?src-supplier=Garrett; ComponentLink31URL: https://datasheet.octopart.com:443/CRCW08051K00FKEA-Vishay-datasheet-148188.pdf?src-supplier=Garrett; ComponentLink31Description: https://datasheet.octopart.com:443/CRCW08051K00FKEA-Vishay-datasheet-148188.pdf?src-supplier=Garrett; ComponentLink32URL: https://datasheet.octopart.com:443/CRCW08051K00FKEA-Vishay-datasheet-34203.pdf?src-supplier=Garrett; ComponentLink32Description: https://datasheet.octopart.com:443/CRCW08051K00FKEA-Vishay-datasheet-34203.pdf?src-supplier=Garrett; ComponentLink33URL: http://sigma.octopart.com:80/rohs_certificate/D-CRCW-e3-Standard-Thick-Film-Chip-Resistors-Vishay-family-102.pdf?src-supplier=Compliance+Statements; ComponentLink33Description: http://sigma.octopart.com:80/rohs_certificate/D-CRCW-e3-Standard-Thick-Film-Chip-Resistors-Vishay-family-102.pdf?src-supplier=Compliance+Statements
R31 = EPCOS, B59901D100A40: Thermistor PTC 100 Ohm 2-Pin Screw Mount Radial Cardboard Strip; Value: 550Ω; Designed by: YS
R32 = NRC10J102TRF: Resistor Thick Film 0805 1K Ohm 5% 0.125W (1/8W) ±200ppm/C Molded Surface Mount Paper; Manufacturer: NIC Components; Power Rating: 125mW; Temperature Coefficient: 200ppm/°C; Voltage Rating (DC): 150V; Supplier: Future Electronics; Supplier Part Number: NRC10J102TRF; Manufacturer Part Number: NRC10J102TRF; RoHS: Compliant; Category: Chip SMD Resistors; Stock: 465000; Pricing: 10000=0,0021, 25000=0,0021, 100000=0,002, 200000=0,002, 500000=0,0019 (USD); Case/Package: 0805; China RoHS: Non-Compliant; Composition: Thick Film; Contact Plating: Tin; Depth: 1.25mm; Height: 500µm; Lead Free: Lead Free; Length: 2mm; Lifecycle Status: Production; Max Operating Temperature: 155°C; Military Standard: Not; Min Operating Temperature: -55°C; Mounting Technology: Surface Mount; Number of Terminals: 2; Ratings: AEC-Q200; REACH SVHC: Yes; Schedule B: 8533210045, 8533210045|8533210045, 8533210045|8533210045|8533210045, 8533210045|8533210045|8533210045|8533210045; Tolerance: 5%; Width: 1.25mm; Working Voltage: 150V; ComponentLink1URL: https://datasheet.octopart.com:443/NRC10J102TRF-NIC-Components-datasheet-182146314.pdf?src-supplier=IHS; ComponentLink1Description: https://datasheet.octopart.com:443/NRC10J102TRF-NIC-Components-datasheet-182146314.pdf?src-supplier=IHS; ComponentLink2URL: https://datasheet.octopart.com/NRC10J102TRF-NIC-Components-datasheet-12509727.pdf; ComponentLink2Description: https://datasheet.octopart.com/NRC10J102TRF-NIC-Components-datasheet-12509727.pdf; ComponentLink3URL: https://datasheet.octopart.com/NRC10J102TRF-NIC-Components-datasheet-10900480.pdf; ComponentLink3Description: https://datasheet.octopart.com/NRC10J102TRF-NIC-Components-datasheet-10900480.pdf; ComponentLink4URL: https://datasheet.octopart.com/NRC10J102TRF-NIC-Components-datasheet-5314492.pdf; ComponentLink4Description: https://datasheet.octopart.com/NRC10J102TRF-NIC-Components-datasheet-5314492.pdf; ComponentLink5URL: https://datasheet.octopart.com:443/NRC10J102TRF-NIC-Components-datasheet-99353785.pdf?src-supplier=Future+Electronics; ComponentLink5Description: https://datasheet.octopart.com:443/NRC10J102TRF-NIC-Components-datasheet-99353785.pdf?src-supplier=Future+Electronics; ComponentLink6URL: https://datasheet.octopart.com:443/NRC10J102TRF-NIC-Components-datasheet-68296053.pdf?src-supplier=Future+Electronics; ComponentLink6Description: https://datasheet.octopart.com:443/NRC10J102TRF-NIC-Components-datasheet-68296053.pdf?src-supplier=Future+Electronics; ComponentLink7URL: https://datasheet.octopart.com:443/NRC10J102TRF-NIC-Components-datasheet-68296057.pdf?src-supplier=Future+Electronics; ComponentLink7Description: https://datasheet.octopart.com:443/NRC10J102TRF-NIC-Components-datasheet-68296057.pdf?src-supplier=Future+Electronics; ComponentLink8URL: https://datasheet.octopart.com:443/NRC10J102TRF-NIC-Components-datasheet-8365846.pdf?src-supplier=Jameco; ComponentLink8Description: https://datasheet.octopart.com:443/NRC10J102TRF-NIC-Components-datasheet-8365846.pdf?src-supplier=Jameco
TP1-TP4 = CMP-2000-05649-1: Banana Jack, Non-Insulated, 1-Pin THD, RoHS, Bulk; Manufacturer: Keystone-Electronics; Package Version: Rev. B, 11/1994; Plug/Mating Plug Diameter: StandardBanana; Gender: Female; Package Reference: 575-4; Operating Temperature: -; Contact Material: Brass; Packaging: Bulk; Series: -; Category: Connectors,Interconnects; Color: -; Type: BananaJack; Contact Finish: Nickel; Features: -; Family: BananaandTipConnectors-Jacks,Plugs; Body Material: -; Manufacturer URL: http://www.keyelco.com/; Termination: Solder; Insulation: Non-Insulated; Datasheet Version: Rev. B, 11/1994; Mounting Technology: ThroughHole; Package URL: http://www.keyelco.com/product-pdf.cfm?p=2379; Mounting Type: ThroughHole; Package Description: 1-Pin Through Hole Device, Dia 7.92 mm; Datasheet URL: http://www.keyelco.com/product-pdf.cfm?p=2379; Wire Gauge: -
U1 = LTC4366HTS8-2#TRPBF: Ms-Hot Swap/High Voltage High Voltage Surge Stopper With Auto-Retry; Manufacturer: Analog Devices; Manufacturer Lifecycle Status: PRODUCTION; Number of Circuits: 1; Working Voltage: 9V; Designed by: YS; Supplier: Mouser; Supplier Part Number: 584-C4366HTS8-2TRPBF; Manufacturer Part Number: LTC4366HTS8-2#TRPBF; RoHS: Compliant; Category: Power Management ICs; Stock: 2236; Pricing: 1=10,82, 10=8,47, 50=7,88, 100=7,36, 1000=7,36, 10000=6,41 (USD); Case/Package: SOT-23-8; Lifecycle Status: Production; Pins: 8; Packaging: Tape and Reel; ComponentLink1URL: https://octopart.com:443/opatz8j6/c1?t=uy-_GR4m-hbMlpErFYYnAgq3WOVugcLWmbs3cjJAK-n1Bzs_cF8hwYV2Rpu4QpWGh801Y4IVUf_1qbrtpUhhFwj7d4htGNrRc54sVUSb7tRkCzjhyFfYLkthzzNwCg0TUrJmNcRhjGVYQ9I9w9eaORv1-syL4hbzeLBxtyVHu092_WIjQYmAJ-1Rm3LA5J_CUNhcuRq-1jxqdtRlrNkSseOqMa5sCy_6phIHhrPNoHu1acCcH4bNeedtEG3MxlQfxpDXpzPsPXuSb-SrX-EbEYP_gXtLDyRv7YeVyxOLvm3YCT1z1r5euA&src-supplier=Analog+Devices; ComponentLink1Description: https://octopart.com:443/opatz8j6/c1?t=uy-_GR4m-hbMlpErFYYnAgq3WOVugcLWmbs3cjJAK-n1Bzs_cF8hwYV2Rpu4QpWGh801Y4IVUf_1qbrtpUhhFwj7d4htGNrRc54sVUSb7tRkCzjhyFfYLkthzzNwCg0TUrJmNcRhjGVYQ9I9w9eaORv1-syL4hbzeLBxtyVHu092_WIjQYmAJ-1Rm3LA5J_CUNhcuRq-1jxqdtRlrNkSseOqMa5sCy_6phIHhrPNoHu1acCcH4bNeedtEG3MxlQfxpDXpzPsPXuSb-SrX-EbEYP_gXtLDyRv7YeVyxOLvm3YCT1z1r5euA&src-supplier=Analog+Devices; ComponentLink2URL: https://datasheet.octopart.com:443/LTC4366HTS8-2%23TRPBF-Linear-Technology-datasheet-17726949.pdf?src-supplier=Linear+Technology; ComponentLink2Description: https://datasheet.octopart.com:443/LTC4366HTS8-2%23TRPBF-Linear-Technology-datasheet-17726949.pdf?src-supplier=Linear+Technology; ComponentLink3URL: https://sigma.octopart.com:443/57695445/technical_drawing/Linear-Technology-LTC4366HTS8-2%23TRPBF.pdf?src-supplier=Linear+Technology; ComponentLink3Description: https://sigma.octopart.com:443/57695445/technical_drawing/Linear-Technology-LTC4366HTS8-2%23TRPBF.pdf?src-supplier=Linear+Technology; ComponentLink4URL: https://datasheet.octopart.com:443/LTC4366HTS8-2%23TRPBF-Linear-Technology-datasheet-10911743.pdf?src-supplier=Component+Distributors+Inc.; ComponentLink4Description: https://datasheet.octopart.com:443/LTC4366HTS8-2%23TRPBF-Linear-Technology-datasheet-10911743.pdf?src-supplier=Component+Distributors+Inc.; ComponentLink5URL: http://sigma.octopart.com:80/conflict_mineral_statement/Analog-Devices-company-33.pdf?src-supplier=Compliance+Statements; ComponentLink5Description: http://sigma.octopart.com:80/conflict_mineral_statement/Analog-Devices-company-33.pdf?src-supplier=Compliance+Statements; ComponentLink6URL: https://octopart.com:443/opatz8j6/c1?t=iIP9RIZi1Pu7nzbQdvSgpdT72kWssvOdbh5mOi_aDmnr93qf2CFp3NCK2OaQ-tLMLunTGN-buU1J2Fgg8ZeLEPrlmoPqTIQLvZ7_2EDygK-yAVlDFh5X5U3q8qhUB9K1b9swnjobhao-nGQgAGaiZXcKR6YnBeogX44UYsC4v7el69I1wkY2g7IYnMJmeyBSmpY5PEqoMMS1o3W7oT3nJSYDAa7QY-0C3accfgij81DVk1_DdePaQhx2ge978IvZsNoJ35iwCPYZsA4mV-7IQkfqUbvat3KpmQtDnoIZV0se_0DwIttisQ&src-supplier=Compliance+Statements; ComponentLink6Description: https://octopart.com:443/opatz8j6/c1?t=iIP9RIZi1Pu7nzbQdvSgpdT72kWssvOdbh5mOi_aDmnr93qf2CFp3NCK2OaQ-tLMLunTGN-buU1J2Fgg8ZeLEPrlmoPqTIQLvZ7_2EDygK-yAVlDFh5X5U3q8qhUB9K1b9swnjobhao-nGQgAGaiZXcKR6YnBeogX44UYsC4v7el69I1wkY2g7IYnMJmeyBSmpY5PEqoMMS1o3W7oT3nJSYDAa7QY-0C3accfgij81DVk1_DdePaQhx2ge978IvZsNoJ35iwCPYZsA4mV-7IQkfqUbvat3KpmQtDnoIZV0se_0DwIttisQ&src-supplier=Compliance+Statements